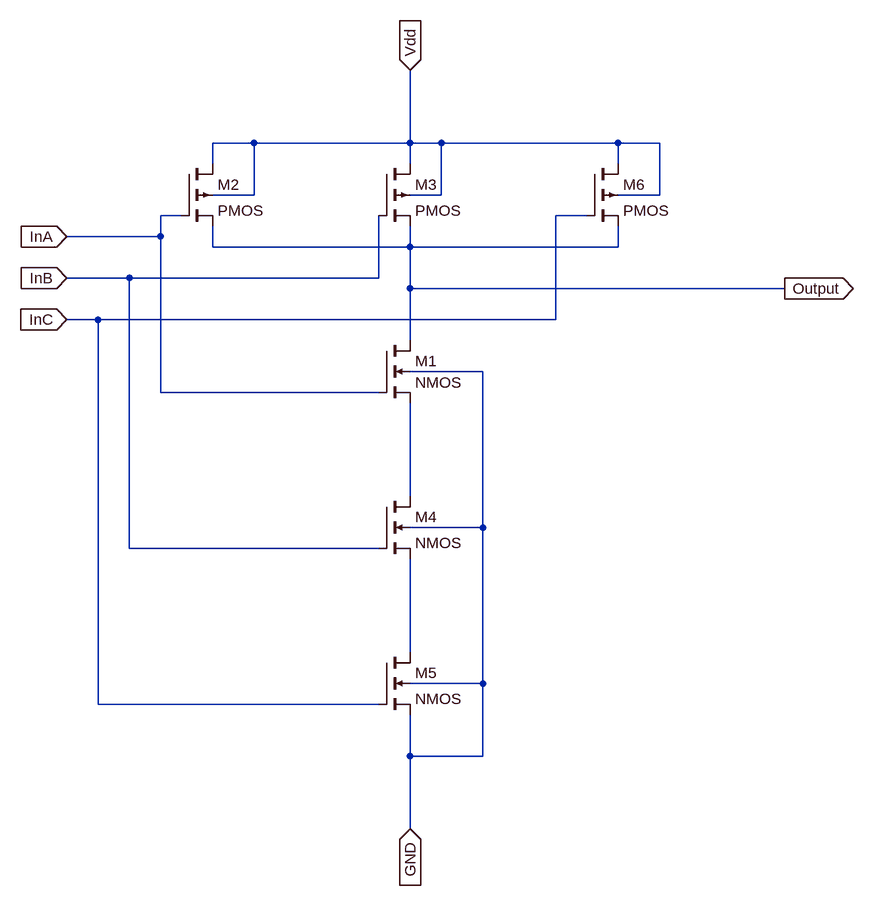
[diagram p0: schematic Nand3.asc]
Nand3.asc, the LTspice schematic file:
Version 4
SHEET 1 892 1328
WIRE -240 144 -304 144
WIRE 0 144 0 32
WIRE 0 144 -240 144
WIRE 48 144 0 144
WIRE 320 144 48 144
WIRE 384 144 320 144
WIRE -304 176 -304 144
WIRE 0 176 0 144
WIRE 320 176 320 144
WIRE -240 224 -240 144
WIRE -240 224 -304 224
WIRE 48 224 48 144
WIRE 48 224 0 224
WIRE 384 224 384 144
WIRE 384 224 320 224
WIRE -352 256 -384 256
WIRE 272 256 224 256
WIRE -384 288 -384 256
WIRE -384 288 -528 288
WIRE -304 304 -304 272
WIRE 0 304 0 272
WIRE 0 304 -304 304
WIRE 320 304 320 272
WIRE 320 304 0 304
WIRE -432 352 -528 352
WIRE -48 352 -48 256
WIRE -48 352 -432 352
WIRE 0 368 0 304
WIRE 576 368 0 368
WIRE -480 416 -528 416
WIRE 224 416 224 256
WIRE 224 416 -480 416
WIRE 0 448 0 368
WIRE 112 496 0 496
WIRE -384 528 -384 288
WIRE -48 528 -384 528
WIRE 0 688 0 544
WIRE 112 736 112 496
WIRE 112 736 0 736
WIRE -432 768 -432 352
WIRE -48 768 -432 768
WIRE 0 928 0 784
WIRE 112 976 112 736
WIRE 112 976 0 976
WIRE -480 1008 -480 416
WIRE -48 1008 -480 1008
WIRE 0 1088 0 1024
WIRE 112 1088 112 976
WIRE 112 1088 0 1088
WIRE 0 1200 0 1088
FLAG -528 288 InA
IOPIN -528 288 In
FLAG -528 352 InB
IOPIN -528 352 In
FLAG 0 32 Vdd
IOPIN 0 32 In
FLAG 576 368 Output
IOPIN 576 368 Out
FLAG -528 416 InC
IOPIN -528 416 In
FLAG 0 1200 GND
IOPIN 0 1200 In
SYMBOL pmos4 -352 176 R0
SYMATTR InstName M2
SYMBOL pmos4 -48 176 R0
SYMATTR InstName M3
SYMBOL nmos4 -48 448 R0
WINDOW 3 56 65 Left 2
SYMATTR InstName M1
SYMBOL nmos4 -48 688 R0
SYMATTR InstName M4
SYMBOL nmos4 -48 928 R0
SYMATTR InstName M5
SYMBOL pmos4 272 176 R0
SYMATTR InstName M6

The netlist it stands for:
* Nand3.asc
M2 Vdd InA Output Vdd PMOS
M3 Vdd InB Output Vdd PMOS
M1 Output InA N001 GND NMOS
M4 N001 InB N002 GND NMOS
M5 N002 InC GND GND NMOS
M6 Vdd InC Output Vdd PMOS
.model NMOS NMOS
.model PMOS PMOS
.lib standard.mos
.backanno
.end